# Altium schematic sheet Socket.SchDoc
size A; SheetNumber: 1; SheetTotal: 1
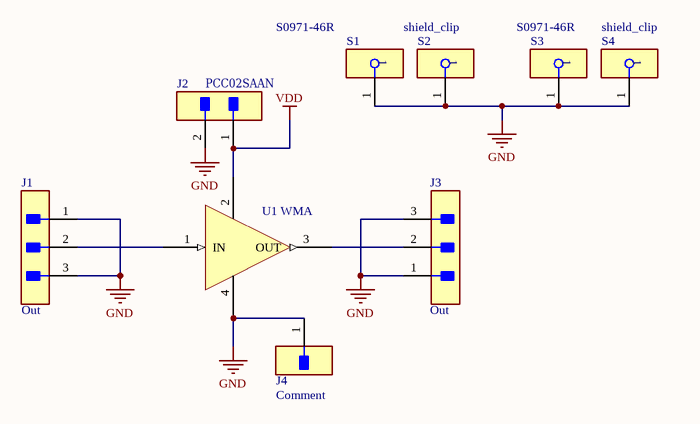
[diagram p0: Socket.SchDoc]

## Parts
J1  Out  [FP-87224-3-MFG]
J2  ‎PCC02SAAN‎  [FP-TSW-102-07-G-S-MFG]
J3  Out  [FP-87224-3-MFG]
J4  Comment  [FP-TSW-101-07-F-S-MFG]
S1  S0971-46R  [FP-S0971-46R-MFG]
S2  shield_clip  [FP-S0971-46R-MFG]
S3  S0971-46R  [FP-S0971-46R-MFG]
S4  shield_clip  [FP-S0971-46R-MFG]
U1  WMA  [WMA-Footprint-1]

## Nets
GND: J1.1 J1.3 J2.2 J3.1 J3.3 J4.1 S1.1 S2.1 S3.1 S4.1 U1.4
VDD: J2.1 U1.2(Vdd)
NetJ1_2: J1.2 U1.1(IN)
NetJ3_2: J3.2 U1.3(OUT)

## Library data of the parts
J1 = CMP-2000-05697-2: CONN HEADER VERT 3POS 2.54MM PCC03SAAN; Number of Positions: 3; Gasket: No (Without); High Speed Serial Data Connector: No; Current Rating: 3A; Contact Post Length: 0.125inch; PCB Thickness: 1.397mm; PCB Mount Retention: Without; Connector Type: Plug; Approvals: CSA; PCB Mounting Orientation: Vertical; Pitch: 2.54mm; Mating Alignment: No (Without); Housing Color: Black; Contact Gender: Male; Length: 7.21mm; Max Operating Temperature: 105°C; Strain Relief: No (Without); Contact Material: Bronze; Row Spacing: 2.54mm; Series: AMPMODU MOD II; Board Standoff: No (Without); Package Quantity: 520; Radiation Hardening: No; Contact Protection: No (Without); Stabilizers: No (Without); Number of Rows: 1; Contact Mating Length: 8.08mm; Contact Shape: Square; Depth: 2.54mm; Contact Current Rating: 3A; Flammability Rating: UL94 V-0; Packaging: Carton; Number of Contacts: 3; Orientation: Straight; Mount: Through Hole; Keyed: No; Contact Type: Male Pin; Housing Material: Thermoplastic; High Temperature Housing: No; ELV: Compliant; Contact Plating: Gold; Termination: Through Hole; Selectively Loaded: No (Without); Lead Free: Lead Free; Min Operating Temperature: -65°C; Mating Connector Lock: No (Without); Color: Black; RoHS Compliant: Yes
J2 = CMP-02766-000084-1: CONN HEADER VERT 2POS 2.54MM; Manufacturer: Samtec; Manufacturer Part Number: TSW-102-07-G-S; Number Of Contacts: 2; Voltage Rating: 550V; Conn Orientation: Straight; Current Rating: 6.3A; Conn Gender: Male; Package: TSW-102-07-G-S; Digikey Description: CONN HEADER VERT 2POS 2.54MM; ComponentLink2URL: http://suddendocs.samtec.com/catalog_english/tsw_th.pdf; Height: 8.71mm; Temperature: -55°C to +125°C; Device Class L2: Headers and Wire Housings; ComponentLink2Description: Datasheet; Device Class L3: unset; Contact Material: Gold,Nickel; Temperature Range Low: -55°C; Temperature Range High: +125°C; RoHS: TRUE; Device Class L1: Connectors; Mouser Description: Conn Unshrouded Header HDR 2 POS 2.54mm Solder ST Thru-Hole Automotive Bulk; Number Of Rows: 1; Category: Conn; Pitch: 2.54mm; Lead Free: Yes; Automotive: No; Footprint Url: http://suddendocs.samtec.com/prints/tsw-xxx-xx-x-x-xx-xxx-footprint.pdf; Octopart: https://octopart.com/tsw-102-07-g-s-samtec-272197
J3 = CMP-2000-05697-2: CONN HEADER VERT 3POS 2.54MM  PCC03SAAN; Number of Positions: 3; Gasket: No (Without); High Speed Serial Data Connector: No; Current Rating: 3A; Contact Post Length: 0.125inch; PCB Thickness: 1.397mm; PCB Mount Retention: Without; Connector Type: Plug; Approvals: CSA; PCB Mounting Orientation: Vertical; Pitch: 2.54mm; Mating Alignment: No (Without); Housing Color: Black; Contact Gender: Male; Length: 7.21mm; Max Operating Temperature: 105°C; Strain Relief: No (Without); Contact Material: Bronze; Row Spacing: 2.54mm; Series: AMPMODU MOD II; Board Standoff: No (Without); Package Quantity: 520; Radiation Hardening: No; Contact Protection: No (Without); Stabilizers: No (Without); Number of Rows: 1; Contact Mating Length: 8.08mm; Contact Shape: Square; Depth: 2.54mm; Contact Current Rating: 3A; Flammability Rating: UL94 V-0; Packaging: Carton; Number of Contacts: 3; Orientation: Straight; Mount: Through Hole; Keyed: No; Contact Type: Male Pin; Housing Material: Thermoplastic; High Temperature Housing: No; ELV: Compliant; Contact Plating: Gold; Termination: Through Hole; Selectively Loaded: No (Without); Lead Free: Lead Free; Min Operating Temperature: -65°C; Mating Connector Lock: No (Without); Color: Black; RoHS Compliant: Yes
J4 = CMP-02766-001403-1: CONN HEADER VERT 1POS PBC01SFAN; Number of Positions: 1; Gender: Male; Contact Material: Bronze; Number of Rows: 1; Termination: Solder; Insulation Material: PBT; Number of Contacts: 1; Min Operating Temperature: -55°C; RoHS Compliant: Yes; Contact Plating: Gold; Contact Shape: Square; Max Operating Temperature: 125°C; Flammability Rating: UL94 V-0; Series: TSW; Connector Type: Header; Packaging: Bulk; Radiation Hardening: No; Insulation Color: Black; Mount: Through Hole; Contact Type: Male Pin; REACH SVHC: No SVHC; Contact Finish - Mating: GOLD; Fastening Type: Pull
S1 S3 = CMP-15817-000004-1: RFI SHIELD CLIP MINI TIN SMD; Manufacturer: Harwin; Is Female: yes; Number Of Contacts: 1; Conn Orientation: Vertical; ComponentLink2URL: https://cdn.harwin.com/pdfs/S0971-46R.pdf; Digikey Description: RFI SHIELD CLIP MINI TIN SMD; ComponentLink2Description: Datasheet; Height: 2.1mm; Mouser Description: EZ-Shield Clip, SMT, Mini, Stainless Steel, tin, Tape & Reeled; Contact Material: Tin,Nickel; RoHS: TRUE; Device Class L1: Connectors; Lead Free: Yes; Package: S0971-46R; Manufacturer Part Number: S0971-46R; Temperature Range High: +150°C; Device Class L2: unset; Category: UNK; Octopart: https://octopart.com/s0971-46r-harwin-30988305; Temperature Range Low: -25°C; Device Class L3: unset; Automotive: No; Temperature: -25°C to +150°C
S2 S4 = CMP-15817-000004-1: RFI SHIELD CLIP MINI TIN SMD; Manufacturer: Harwin; Manufacturer Part Number: S0971-46R; Is Female: yes; Number Of Contacts: 1; Conn Orientation: Vertical; ComponentLink2URL: https://cdn.harwin.com/pdfs/S0971-46R.pdf; Digikey Description: RFI SHIELD CLIP MINI TIN SMD; ComponentLink2Description: Datasheet; Height: 2.1mm; Mouser Description: EZ-Shield Clip, SMT, Mini, Stainless Steel, tin, Tape & Reeled; Contact Material: Tin,Nickel; RoHS: TRUE; Device Class L1: Connectors; Lead Free: Yes; Package: S0971-46R; Temperature Range High: +150°C; Device Class L2: unset; Category: UNK; Octopart: https://octopart.com/s0971-46r-harwin-30988305; Temperature Range Low: -25°C; Device Class L3: unset; Automotive: No; Temperature: -25°C to +150°C
U1 = CMP-014-00002-11: WanTcom SMT Series Preamplifiers  0.6"x0.4" footprint